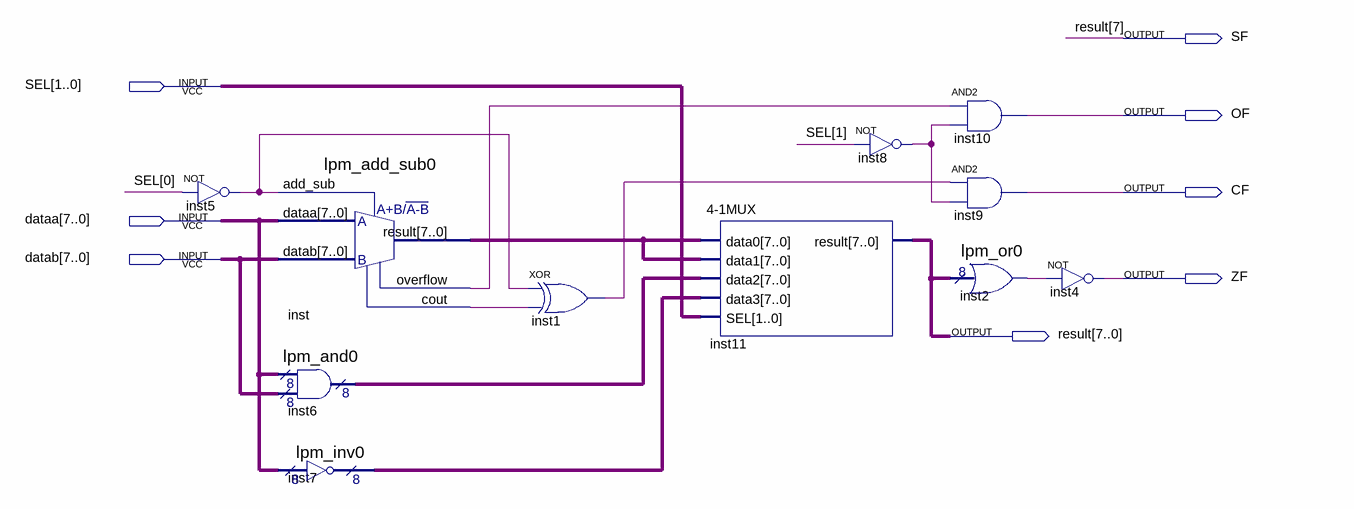
[diagram p0: schematic sheet]
// Quartus schematic EX_2.bdf as structural Verilog: 11 symbols, 8 pins
module EX_2 (
  input  [1:0] SEL,
  input  [7:0] dataa,
  input  [7:0] datab,
  output SF,
  output OF,
  output CF,
  output ZF,
  output [7:0] result
);

  wire inst1_out, inst2_result, inst5_out, inst8_out, inst_cout, inst_overflow;
  wire [7:0] inst6_result, inst7_result, inst_result;

  not inst5 (inst5_out, SEL[0]);
  lpm_add_sub0 inst (
    .dataa(dataa), .datab(datab), .add_sub(inst5_out), .result(inst_result), .overflow(inst_overflow),
    .cout(inst_cout));
  lpm_and0 inst6 (.data0x(dataa), .data1x(datab), .result(inst6_result));
  lpm_inv0 inst7 (.data(dataa), .result(inst7_result));
  xor inst1 (inst1_out, inst5_out, inst_cout);
  \4-1MUX  inst11 (
    .data0(inst_result), .data1(inst_result), .data2(inst6_result), .data3(inst7_result), .SEL(SEL),
    .result(result));
  not inst8 (inst8_out, SEL[1]);
  and inst10 (OF, inst_overflow, inst8_out);
  and inst9 (CF, inst1_out, inst8_out);
  lpm_or0 inst2 (.data(result), .result(inst2_result));
  not inst4 (ZF, inst2_result);

  assign SF = result[7];
endmodule
